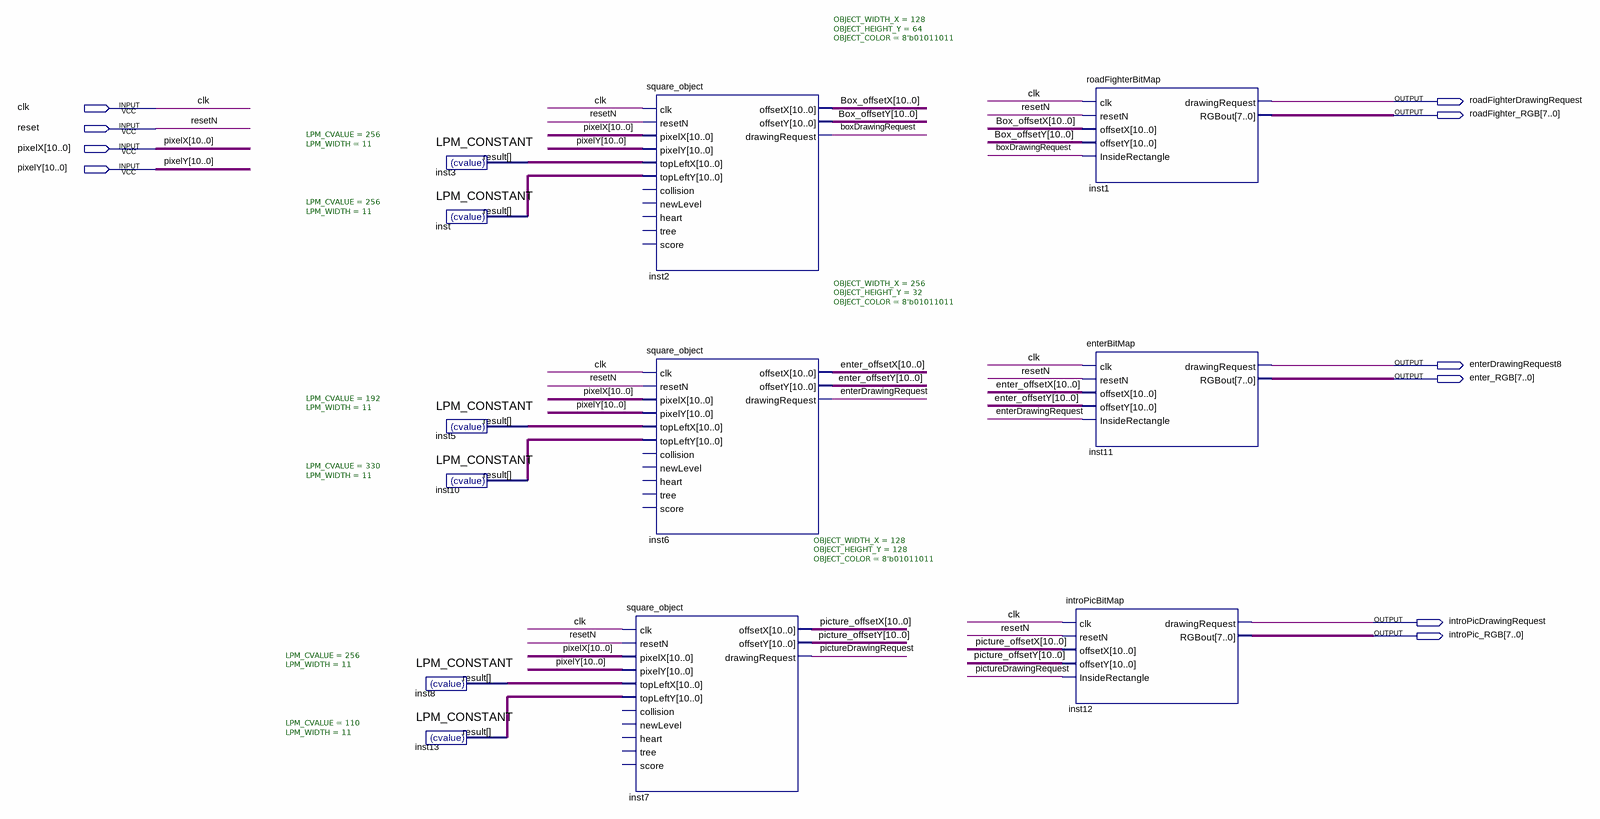
[diagram p0: schematic sheet]
// Quartus schematic startBG_Block.bdf as structural Verilog: 12 symbols, 10 pins
module startBG_Block (
  input  clk,
  input  reset,
  input  [10:0] pixelX,
  input  [10:0] pixelY,
  output roadFighterDrawingRequest,
  output [7:0] roadFighter_RGB,
  output enterDrawingRequest8,
  output [7:0] enter_RGB,
  output introPicDrawingRequest,
  output [7:0] introPic_RGB
);

  wire boxDrawingRequest, enterDrawingRequest, pictureDrawingRequest;
  wire [10:0] Box_offsetX, Box_offsetY, enter_offsetX, enter_offsetY, inst3_result, inst5_result,
       inst8_result, inst10_result, inst13_result, inst_result, picture_offsetX, picture_offsetY;

  LPM_CONSTANT #(.LPM_CVALUE(256), .LPM_WIDTH(11)) inst8 (.result(inst8_result));
  LPM_CONSTANT #(.LPM_CVALUE(110), .LPM_WIDTH(11)) inst13 (.result(inst13_result));
  LPM_CONSTANT #(.LPM_CVALUE(256), .LPM_WIDTH(11)) inst3 (.result(inst3_result));
  LPM_CONSTANT #(.LPM_CVALUE(256), .LPM_WIDTH(11)) inst (.result(inst_result));
  LPM_CONSTANT #(.LPM_CVALUE(192), .LPM_WIDTH(11)) inst5 (.result(inst5_result));
  LPM_CONSTANT #(.LPM_CVALUE(330), .LPM_WIDTH(11)) inst10 (.result(inst10_result));
  square_object #(.OBJECT_WIDTH_X(128), .OBJECT_HEIGHT_Y(64), .OBJECT_COLOR(8'b01011011)) inst2 (
    .clk(clk), .resetN(reset), .pixelX(pixelX), .pixelY(pixelY), .topLeftX(inst3_result),
    .topLeftY(inst_result), .offsetX(Box_offsetX), .offsetY(Box_offsetY), .drawingRequest(boxDrawingRequest));  // open: collision, newLevel, heart, tree, score
  square_object #(.OBJECT_WIDTH_X(256), .OBJECT_HEIGHT_Y(32), .OBJECT_COLOR(8'b01011011)) inst6 (
    .clk(clk), .resetN(reset), .pixelX(pixelX), .pixelY(pixelY), .topLeftX(inst5_result),
    .topLeftY(inst10_result), .offsetX(enter_offsetX), .offsetY(enter_offsetY),
    .drawingRequest(enterDrawingRequest));  // open: collision, newLevel, heart, tree, score
  square_object #(.OBJECT_WIDTH_X(128), .OBJECT_HEIGHT_Y(128), .OBJECT_COLOR(8'b01011011)) inst7 (
    .clk(clk), .resetN(reset), .pixelX(pixelX), .pixelY(pixelY), .topLeftX(inst8_result),
    .topLeftY(inst13_result), .offsetX(picture_offsetX), .offsetY(picture_offsetY),
    .drawingRequest(pictureDrawingRequest));  // open: collision, newLevel, heart, tree, score
  introPicBitMap inst12 (
    .clk(clk), .resetN(reset), .offsetX(picture_offsetX), .offsetY(picture_offsetY),
    .InsideRectangle(pictureDrawingRequest), .drawingRequest(introPicDrawingRequest), .RGBout(introPic_RGB));
  roadFighterBitMap inst1 (
    .clk(clk), .resetN(reset), .offsetX(Box_offsetX), .offsetY(Box_offsetY),
    .InsideRectangle(boxDrawingRequest), .drawingRequest(roadFighterDrawingRequest), .RGBout(roadFighter_RGB));
  enterBitMap inst11 (
    .clk(clk), .resetN(reset), .offsetX(enter_offsetX), .offsetY(enter_offsetY),
    .InsideRectangle(enterDrawingRequest), .drawingRequest(enterDrawingRequest8), .RGBout(enter_RGB));

  // Other names for the same wires on the sheet: resetN = reset
endmodule
